# EAGLE design dual.vca.pnl (EAGLE 7.2.0)
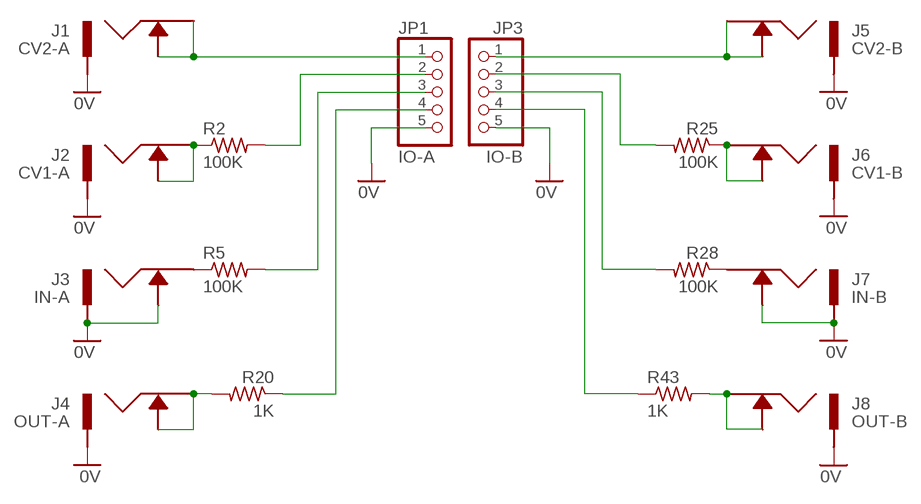
[diagram p0: schematic, sheet 1]

## Parts
J1  CV2-A  ACJM-MV35-2S  [ACJM-MV35-2S]
J2  CV1-A  ACJM-MV35-2S  [ACJM-MV35-2S]
J3  IN-A  ACJM-MV35-2S  [ACJM-MV35-2S]
J4  OUT-A  ACJM-MV35-2S  [ACJM-MV35-2S]
J5  CV2-B  ACJM-MV35-2S  [ACJM-MV35-2S]
J6  CV1-B  ACJM-MV35-2S  [ACJM-MV35-2S]
J7  IN-B  ACJM-MV35-2S  [ACJM-MV35-2S]
J8  OUT-B  ACJM-MV35-2S  [ACJM-MV35-2S]
JP1  IO-A  PINHD-1X5  [1X05]
JP3  IO-B  PINHD-1X5  [1X05]
R2  100K  R-US_0207/7  [0207/7]
R5  100K  R-US_0207/7  [0207/7]
R20  1K  R-US_0207/7  [0207/7]
R25  100K  R-US_0207/7  [0207/7]
R28  100K  R-US_0207/7  [0207/7]
R43  1K  R-US_0207/7  [0207/7]

## Nets
0V: J1.P$1 J2.P$1 J3.P$1 J3.P$2 J4.P$1 J5.P$1 J6.P$1 J7.P$1 J7.P$2 J8.P$1 JP1.5 JP3.5
N$1: J2.P$2 J2.P$3 R2.1
N$2: J4.P$2 J4.P$3 R20.2
N$3: JP1.2 R2.2
N$4: JP1.3 R5.2
N$5: JP1.4 R20.1
N$7: JP3.2 R25.2
N$8: JP3.3 R28.2
N$9: JP3.4 R43.1
N$11: J3.P$3 R5.1
N$16: J1.P$2 J1.P$3 JP1.1
N$23: J6.P$2 J6.P$3 R25.1
N$24: J8.P$2 J8.P$3 R43.2
N$32: J7.P$3 R28.1
N$37: J5.P$2 J5.P$3 JP3.1

## Library data of the parts
J1-J8 = jacks:ACJM-MV35-2S: Amphenol 3.5mm Jack (Vertical) ACJM-MV35-2S http://ca.mouser.com/Search/ProductDetail.aspx?R=ACJM-MV35-2Svirtualkey52380000virtualkey523-ACJMMV352S
JP1 JP3 = pinhead:PINHD-1X5: PIN HEADER
R2 R5 R20 R25 R28 R43 = resistor:R-US_: RESISTOR, American symbol

## Board
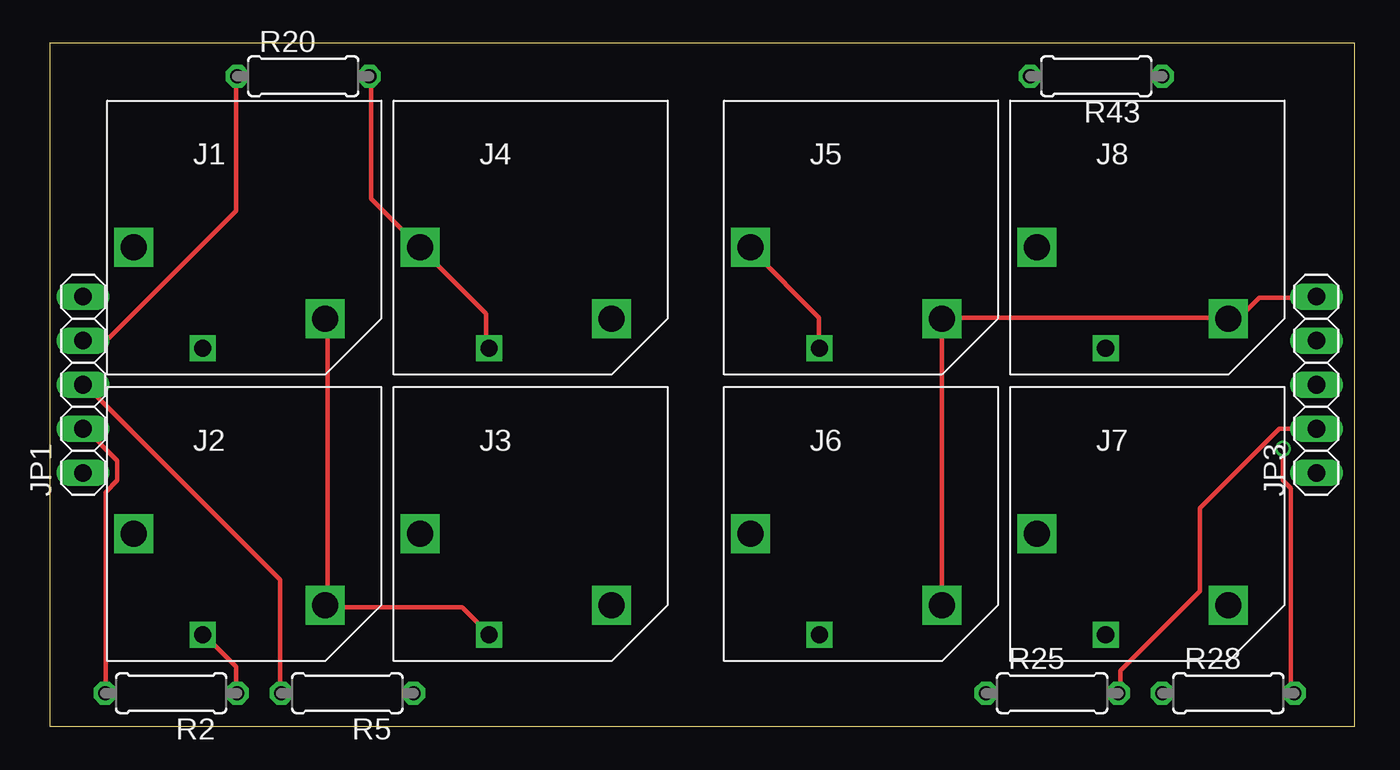
[diagram p1: board, top side]
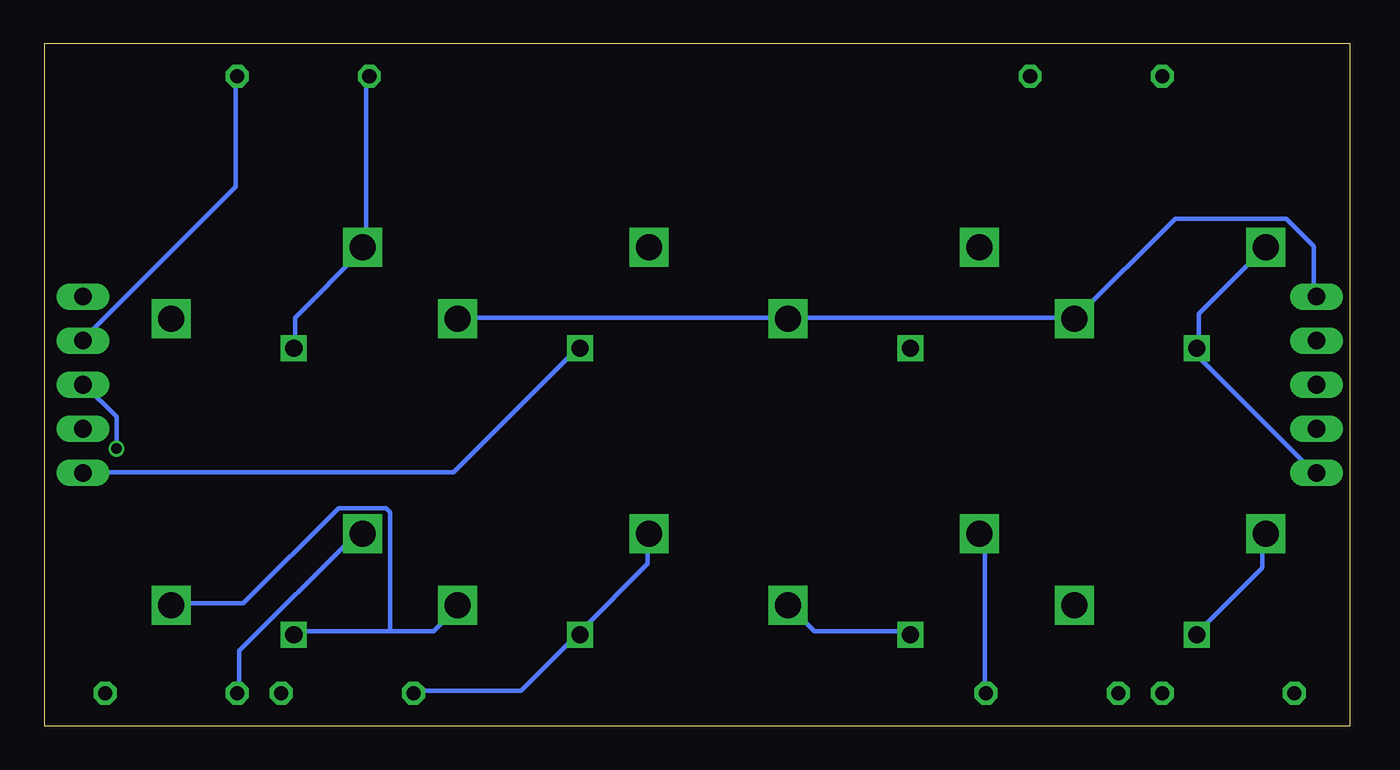
[diagram p2: board, bottom side, seen from below]

Size 75.23 x 39.36 mm. Coordinates in mm from the lower left corner, seen from the top.
Outline: 0,0 75.23,0 75.23,39.36 0,39.36 0,0
Copper layers (1*16): Top 0.035mm / dielectric 1.5mm / Bottom 0.035mm
Design rules "SeeedStudio_2layer_DRU_no_angle_20140221": minimum track width 6mil, minimum drill 12mil, track to track 6mil, track to pad 6mil, pad to pad 6mil, via to via 6mil, smd to smd 0mil, copper to edge 10mil, drill to drill 10mil, minimum pad ring 10mil, minimum via ring 6mil, stop-mask expansion 2mil, vias tented up to drill 100mil, thermal gap 10mil

### Footprints (pad centres in the part's own frame; a part is rotated, then mirrored left to right if it is on the bottom)
ACJM-MV35-2S = drill 1.5 square: P$1 0,0; P$3 -11.05,4.11 | drill 1 square: P$2 -7.07,-1.71
1X05 = drill 1.016 long: 1 -5.08,0; 2 -2.54,0; 3 0,0; 4 2.54,0; 5 5.08,0
0207/7 = drill 0.813 octagon: 1 -3.81,0; 2 3.81,0

### Placement (x,y rotation side)
J1  15.88,23.5 0 top
J2  15.88,6.99 0 top
J3  32.38,6.99 0 top
J4  32.38,23.5 0 top
J5  51.44,23.5 0 top
J6  51.44,6.99 0 top
J7  67.94,6.99 0 top
J8  67.94,23.5 0 top
JP1  1.91,19.68 90 top
JP3  73.03,19.68 90 top
R2  6.99,1.91 180 top
R5  17.14,1.91 180 top
R20  14.61,37.47 0 top
R25  57.78,1.91 0 top
R28  67.94,1.91 0 top
R43  60.33,37.47 180 top

### Tracks (layer width: path | path; a pad name or v marks a point on that pad's centre or on a via)
0V
  Top 0.254: JP3.5 72.92,24.69 69.72,24.69 68.58,23.55 68.12,23.55 J8.P$1 67.89,23.55 51.44,23.55 J5.P$1 J6.P$1 | J3.P$2 25.15,5.49 23.77,6.86 16,6.86 J2.P$1 16,7.09 16,23.32 J1.P$1
  Bottom 0.254: 55.32,5.49 52.81,5.49 51.44,6.86 J6.P$1 | 55.32,5.49 60.81,5.49 J7.P$2 | 55.32,5.49 55.32,12.34 55.55,12.57 58.29,12.57 63.78,7.09 67.89,7.09 J7.P$1 | J3.P$2 25.38,5.49 30.86,5.49 32.23,6.86 J3.P$1 | JP1.5 2.06,24.92 2.06,27.66 3.66,29.26 10.06,29.26 15.77,23.55 J1.P$1 16,23.55 32.23,23.55 J4.P$1 32.46,23.55 51.44,23.55 J5.P$1
N$1
  Top 0.254: R2.1 10.74,2.06 10.74,3.43 8.91,5.26 J2.P$2
  Bottom 0.254: J2.P$3 5.03,10.97 5.03,9.14 8.69,5.49 J2.P$2
N$2
  Top 0.254: R20.2 18.52,37.26 18.52,30.4 21.26,27.66 J4.P$3 21.49,27.43 25.15,23.77 25.15,21.95 J4.P$2
N$3
  Top 0.254: R2.2 3.2,2.06 3.2,13.49 3.89,14.17 3.89,15.32 2.06,17.14 JP1.2
N$4
  Top 0.254: R5.2 13.26,2.06 13.26,8.46 2.06,19.66 JP1.3
N$5
  Top 0.254: R20.1 10.74,37.26 10.74,29.72 3.43,22.4 2.06,22.4 JP1.4
N$7
  Top 0.254: JP3.2 70.87,17.14 66.29,12.57 66.29,7.77 61.72,3.2 61.72,2.06 R25.2
N$8  (via drill 0.61)
  Top 0.254: v71.09,16 71.09,14.17 71.55,13.72 71.55,2.06 R28.2
  Bottom 0.254: v71.09,16 71.09,17.83 72.92,19.66 JP3.3
N$9
  Bottom 0.254: R43.1 64.24,37.26 64.24,31.09 72.92,22.4 JP3.4
N$11
  Bottom 0.254: R5.1 21.03,2.06 21.03,10.74 21.26,10.97 J3.P$3
N$16
  Bottom 0.254: J1.P$3 5.03,27.43 8.69,23.77 8.69,21.95 J1.P$2 8.69,21.72 8.69,21.26 2.06,14.63 JP1.1
N$23
  Bottom 0.254: R25.1 53.95,2.06 47.78,2.06 44.58,5.26 J6.P$2 44.35,5.49 40.46,9.37 40.46,10.97 J6.P$3
N$24
  Bottom 0.254: R43.2 56.69,37.26 56.69,27.66 J8.P$3 56.92,27.43 60.81,23.55 60.81,21.95 J8.P$2
N$32
  Bottom 0.254: R28.1 64.01,2.06 64.01,4.34 57.38,10.97 56.92,10.97 J7.P$3
N$37
  Top 0.254: J5.P$2 44.35,21.95 44.35,23.55 40.46,27.43 J5.P$3
  Bottom 0.254: JP3.1 72.92,14.63 51.66,14.63 44.58,21.72 J5.P$2